# Altium schematic sheet FPGA.SchDoc
size A4
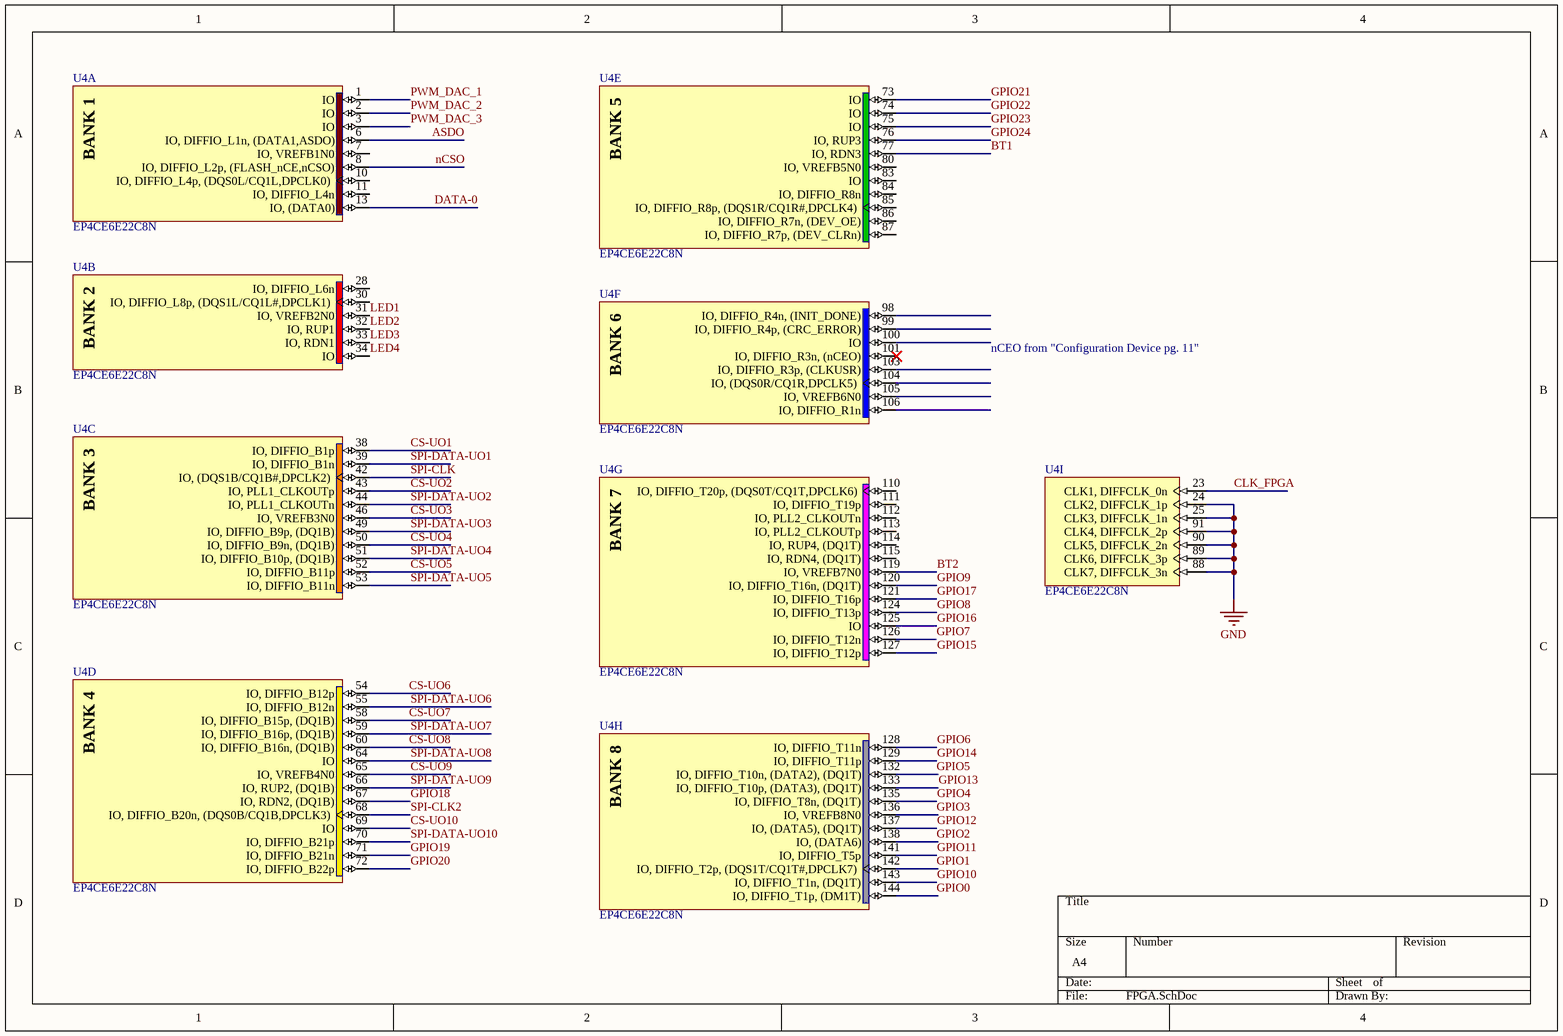
[diagram p0: FPGA.SchDoc]

## Parts
U4  EP4CE6E22C8N  [EQFP144_M]  (parts A,B,C,D,E,F,G,H,I of 13)

## Nets
GND: U4.24(CLK2,_DIFFCLK_1p) U4.25(CLK3,_DIFFCLK_1n) U4.88(CLK7,_DIFFCLK_3n) U4.89(CLK6,_DIFFCLK_3p) U4.90(CLK5,_DIFFCLK_2n) U4.91(CLK4,_DIFFCLK_2p)
ASDO: U4.6(IO,_DIFFIO_L1n,_(DATA1,ASDO))
BT1: U4.77(IO,_RDN3)
BT2: U4.119(IO,_VREFB7N0)
CLK_FPGA: U4.23(CLK1,_DIFFCLK_0n)
CS-UO1: U4.38(IO,_DIFFIO_B1p)
CS-UO2: U4.43(IO,_PLL1_CLKOUTp)
CS-UO3: U4.46(IO,_VREFB3N0)
CS-UO4: U4.50(IO,_DIFFIO_B9n,_(DQ1B))
CS-UO5: U4.52(IO,_DIFFIO_B11p)
CS-UO6: U4.54(IO,_DIFFIO_B12p)
CS-UO7: U4.58(IO,_DIFFIO_B15p,_(DQ1B))
CS-UO8: U4.60(IO,_DIFFIO_B16n,_(DQ1B))
CS-UO9: U4.65(IO,_VREFB4N0)
CS-UO10: U4.69(IO)
DATA-0: U4.13(IO,_(DATA0))
GPIO0: U4.144(IO,_DIFFIO_T1p,_(DM1T))
GPIO1: U4.142(IO,_DIFFIO_T2p,_(DQS1T/CQ1T#,DPCLK7))
GPIO2: U4.138(IO,_(DATA6))
GPIO3: U4.136(IO,_VREFB8N0)
GPIO4: U4.135(IO,_DIFFIO_T8n,_(DQ1T))
GPIO5: U4.132(IO,_DIFFIO_T10n,_(DATA2),_(DQ1T))
GPIO6: U4.128(IO,_DIFFIO_T11n)
GPIO7: U4.126(IO,_DIFFIO_T12n)
GPIO8: U4.124(IO,_DIFFIO_T13p)
GPIO9: U4.120(IO,_DIFFIO_T16n,_(DQ1T))
GPIO10: U4.143(IO,_DIFFIO_T1n,_(DQ1T))
GPIO11: U4.141(IO,_DIFFIO_T5p)
GPIO12: U4.137(IO,_(DATA5),_(DQ1T))
GPIO13: U4.133(IO,_DIFFIO_T10p,_(DATA3),_(DQ1T))
GPIO14: U4.129(IO,_DIFFIO_T11p)
GPIO15: U4.127(IO,_DIFFIO_T12p)
GPIO16: U4.125(IO)
GPIO17: U4.121(IO,_DIFFIO_T16p)
GPIO18: U4.67(IO,_RDN2,_(DQ1B))
GPIO19: U4.71(IO,_DIFFIO_B21n)
GPIO20: U4.72(IO,_DIFFIO_B22p)
GPIO21: U4.73(IO)
GPIO22: U4.74(IO)
GPIO23: U4.75(IO)
GPIO24: U4.76(IO,_RUP3)
LED1: U4.31(IO,_VREFB2N0)
LED2: U4.32(IO,_RUP1)
LED3: U4.33(IO,_RDN1)
LED4: U4.34(IO)
nCSO: U4.8(IO,_DIFFIO_L2p,_(FLASH_nCE,nCSO))
PWM_DAC_1: U4.1(IO)
PWM_DAC_2: U4.2(IO)
PWM_DAC_3: U4.3(IO)
SPI-CLK: U4.42(IO,_(DQS1B/CQ1B#,DPCLK2))
SPI-CLK2: U4.68(IO,_DIFFIO_B20n,_(DQS0B/CQ1B,DPCLK3))
SPI-DATA-UO1: U4.39(IO,_DIFFIO_B1n)
SPI-DATA-UO2: U4.44(IO,_PLL1_CLKOUTn)
SPI-DATA-UO3: U4.49(IO,_DIFFIO_B9p,_(DQ1B))
SPI-DATA-UO4: U4.51(IO,_DIFFIO_B10p,_(DQ1B))
SPI-DATA-UO5: U4.53(IO,_DIFFIO_B11n)
SPI-DATA-UO6: U4.55(IO,_DIFFIO_B12n)
SPI-DATA-UO7: U4.59(IO,_DIFFIO_B16p,_(DQ1B))
SPI-DATA-UO8: U4.64(IO)
SPI-DATA-UO9: U4.66(IO,_RUP2,_(DQ1B))
SPI-DATA-UO10: U4.70(IO,_DIFFIO_B21p)

Not connected (* = marked no-connect by the designer): U4 7(IO,_VREFB1N0) 10(IO,_DIFFIO_L4p,_(DQS0L/CQ1L,DPCLK0)) 11(IO,_DIFFIO_L4n) 28(IO,_DIFFIO_L6n) 30(IO,_DIFFIO_L8p,_(DQS1L/CQ1L#,DPCLK1)) 80(IO,_VREFB5N0) 83(IO) 84(IO,_DIFFIO_R8n) 85(IO,_DIFFIO_R8p,_(DQS1R/CQ1R#,DPCLK4)) 86(IO,_DIFFIO_R7n,_(DEV_OE)) 87(IO,_DIFFIO_R7p,_(DEV_CLRn)) 98(IO,_DIFFIO_R4n,_(INIT_DONE)) 99(IO,_DIFFIO_R4p,_(CRC_ERROR)) 100(IO) 101(IO,_DIFFIO_R3n,_(nCEO))* 103(IO,_DIFFIO_R3p,_(CLKUSR)) 104(IO,_(DQS0R/CQ1R,DPCLK5)) 105(IO,_VREFB6N0) 106(IO,_DIFFIO_R1n) 110(IO,_DIFFIO_T20p,_(DQS0T/CQ1T,DPCLK6)) 111(IO,_DIFFIO_T19p) 112(IO,_PLL2_CLKOUTn) 113(IO,_PLL2_CLKOUTp) 114(IO,_RUP4,_(DQ1T)) 115(IO,_RDN4,_(DQ1T))

## Notes on the sheet
- nCEO from "Configuration Device pg. 11"
- (in symbol EP4CE6E22C8N, part A) BANK 1
- (in symbol EP4CE6E22C8N, part B) BANK 2
- (in symbol EP4CE6E22C8N, part C) BANK 3
- (in symbol EP4CE6E22C8N, part D) BANK 4
- (in symbol EP4CE6E22C8N, part E) BANK 5
- (in symbol EP4CE6E22C8N, part F) BANK 6
- (in symbol EP4CE6E22C8N, part G) BANK 7
- (in symbol EP4CE6E22C8N, part H) BANK 8

## Library data of the parts
U4 = EP4CE6E22C8N: IC FPGA 91 I/O 144EQFP; Supplier 1: Digi-Key; Supplier Part Number 1: 544-2746-ND